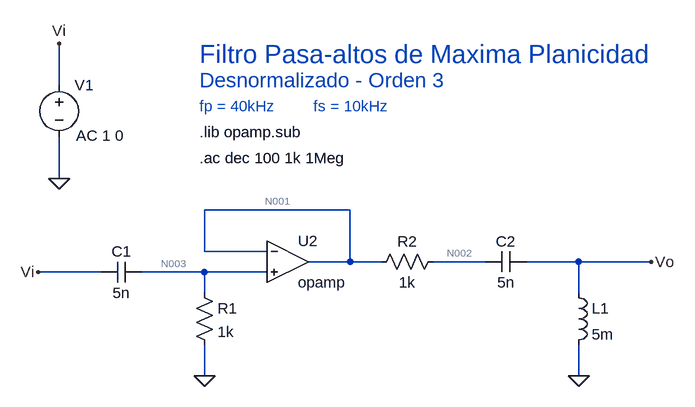
[diagram p0: schematic Circuito_Desnormalizado.asc]
Circuito_Desnormalizado.asc, the LTspice schematic file:
Version 4
SHEET 1 940 680
WIRE -32 -208 -32 -272
WIRE -32 -64 -32 -128
WIRE 416 -16 192 -16
WIRE 192 48 192 -16
WIRE 288 48 192 48
WIRE 416 64 416 -16
WIRE 416 64 352 64
WIRE 464 64 416 64
WIRE 624 64 544 64
WIRE 768 64 688 64
WIRE 880 64 768 64
WIRE 32 80 -64 80
WIRE 192 80 96 80
WIRE 288 80 192 80
WIRE 192 112 192 80
WIRE 768 112 768 64
WIRE 192 240 192 192
WIRE 768 240 768 192
FLAG -32 -64 0
FLAG -32 -272 Vi
FLAG 192 240 0
FLAG 768 240 0
FLAG -64 80 Vi
FLAG 880 64 Vo
SYMBOL voltage -32 -224 R0
WINDOW 123 26 94 Left 2
WINDOW 39 0 0 Left 0
SYMATTR Value2 AC 1 0
SYMATTR InstName V1
SYMATTR Value ""
SYMBOL OpAmps\\opamp 320 0 R0
SYMATTR InstName U2
SYMBOL res 560 48 R90
WINDOW 0 0 56 VBottom 2
WINDOW 3 32 56 VTop 2
SYMATTR InstName R2
SYMATTR Value 1k
SYMBOL cap 688 48 R90
WINDOW 0 0 32 VBottom 2
WINDOW 3 32 32 VTop 2
SYMATTR InstName C2
SYMATTR Value 5n
SYMBOL ind 752 96 R0
SYMATTR InstName L1
SYMATTR Value 5m
SYMBOL cap 96 64 R90
WINDOW 0 0 32 VBottom 2
WINDOW 3 32 32 VTop 2
SYMATTR InstName C1
SYMATTR Value 5n
SYMBOL res 176 96 R0
SYMATTR InstName R1
SYMATTR Value 1k
TEXT 184 -136 Left 2 !.lib opamp.sub
TEXT 184 -96 Left 2 !.ac dec 100 1k 1Meg
TEXT 184 -256 Left 4 ;Filtro Pasa-altos de Maxima Planicidad
TEXT 184 -216 Left 3 ;Desnormalizado - Orden 3
TEXT 184 -176 Left 2 ;fp = 40kHz
TEXT 360 -176 Left 2 ;fs = 10kHz

The netlist it stands for:
* Circuito_Desnormalizado.asc
V1 Vi 0 AC 1 0
XU2 N001 N003 N001 opamp Aol=100K GBW=10Meg  ; pins invin noninvin out
R2 N002 N001 1k
C2 Vo N002 5n
L1 Vo 0 5m
C1 N003 Vi 5n
R1 N003 0 1k
.lib opamp.sub
.ac dec 100 1k 1Meg
* Filtro Pasa-altos de Maxima Planicidad
* Desnormalizado - Orden 3
* fp = 40kHz
* fs = 10kHz
.backanno
.end

* Results of the author's LTspice run, read from the files saved beside the schematic
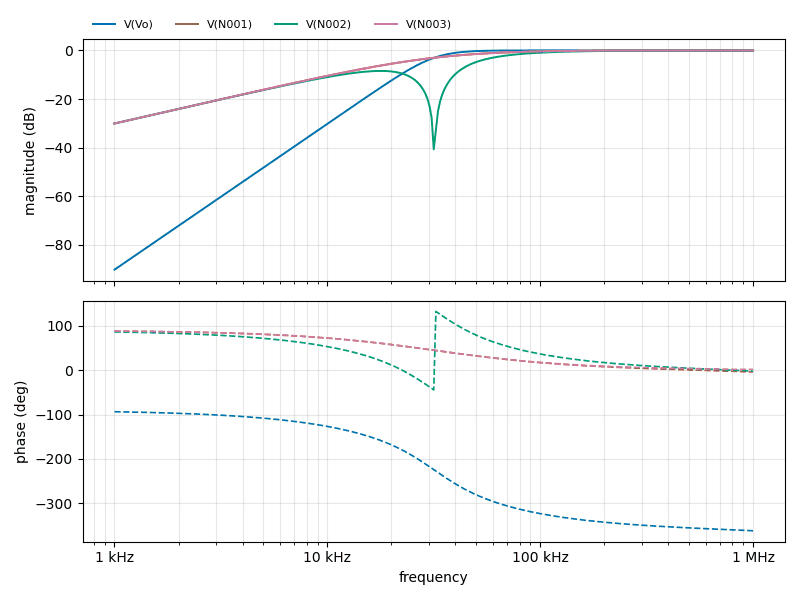
[diagram p1: AC Analysis of Circuito_Desnormalizado.asc, plotted from the saved traces]
* AC Analysis, 1 run:
*   V(Vo): -90.17 dB at 1 kHz, -0.04 dB at 1 MHz, peak -0.00 dB at 154.9 kHz, 3 dB below the peak at 31.83 kHz
*   V(N001): -30.06 dB at 1 kHz, -0.05 dB at 1 MHz, peak -0.03 dB at 562.3 kHz, 3 dB below the peak at 31.63 kHz
*   V(N002): -30.07 dB at 1 kHz, -0.05 dB at 1 MHz, peak -0.04 dB at 676.1 kHz, 3 dB below the peak at 59.35 kHz
*   V(N003): -30.06 dB at 1 kHz, -0.00 dB at 1 MHz, peak -0.00 dB at 1 MHz, 3 dB below the peak at 31.8 kHz